# Altium project PA_Transmitter_1LD_ExtVoltage.PrjPcb
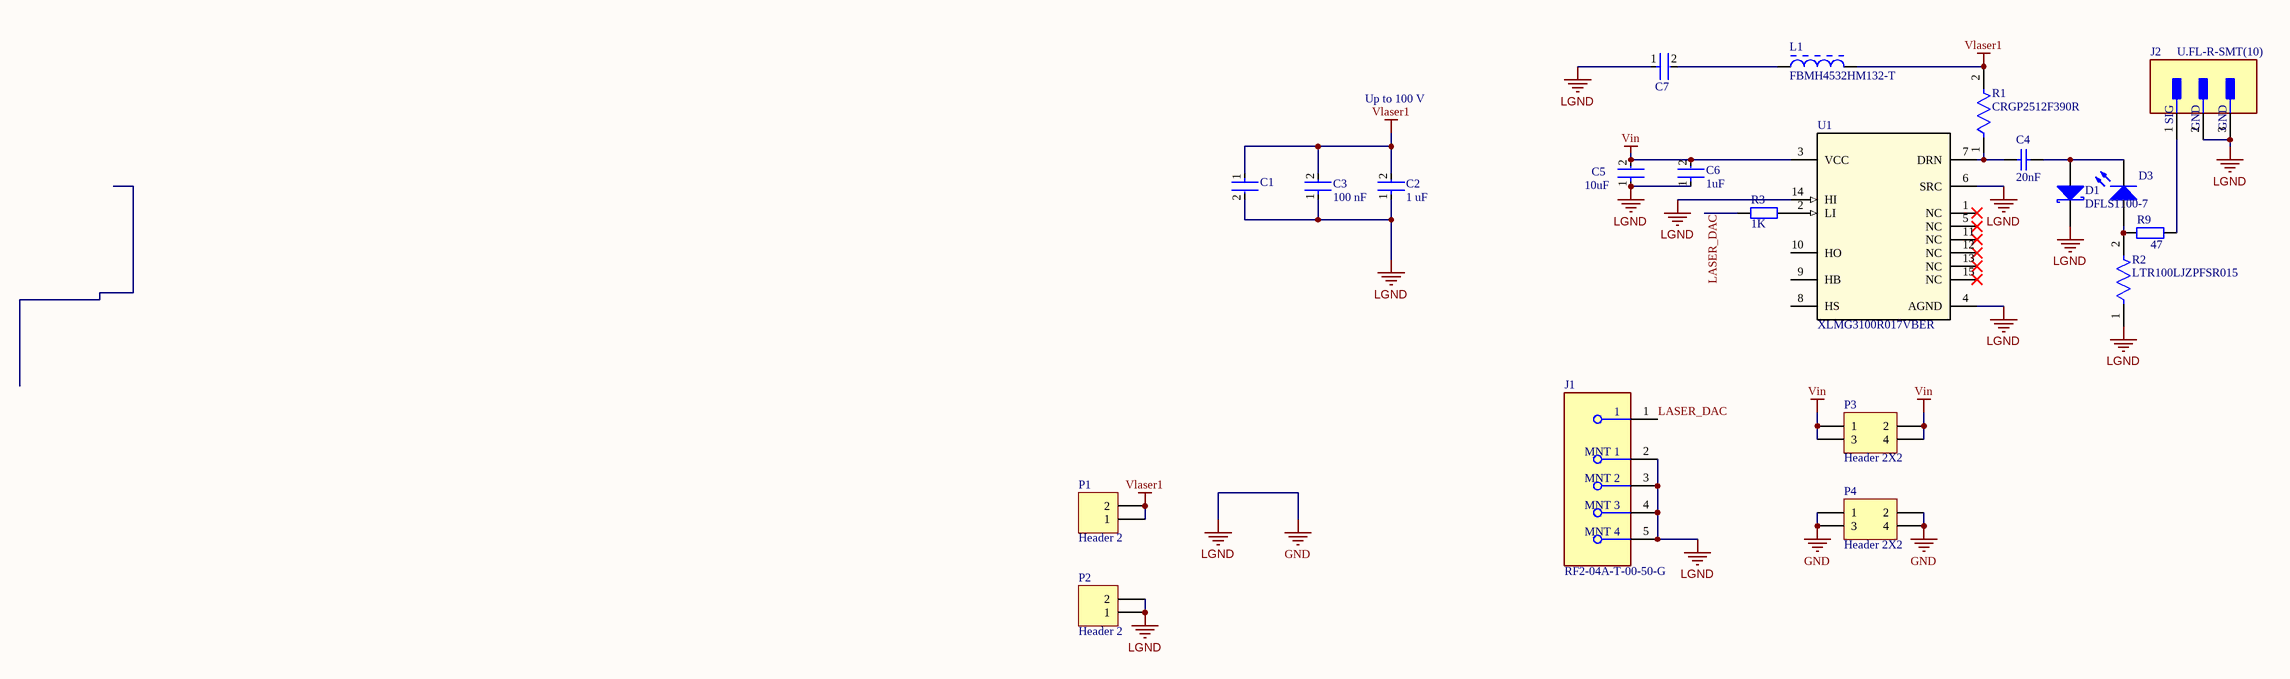
[diagram p0: PA_Transmitter_1LD_ExtVoltage.SchDoc]
1 sheet, 21 parts. Net scope: global (net labels, ports and power ports of the same name join across sheets).
Board file: PA_Transmitter_1LD_ExtVoltage.PcbDoc

## Sheet PA_Transmitter_1LD_ExtVoltage.SchDoc
size A3; PageSetup: Record=PageOptions|CenterHorizontal=True|CenterVertical=True|PrintScale=0.73|XCorrection=1.00|YCorrection=1.00|PrintKind=0|BorderSize=5000000|LeftOffset=0|BottomOffset=0|Orientation=2|PaperLength=1000|PaperWidth=1000|Scale=100|PaperSource=7|PrintQuality=-3|MediaType=1|DitherType=10|PrintScaleMode=1|PaperKind=A4|PaperIndex=9

### Parts
C1  CC1210KKX7R9BB105  [FP-CC1210-GA-MFG]  (value not drawn)
C2  1 uF  [FP-CL31B106KBHNNNE-MFG]
C3  100 nF  [FP-CL31B106KBHNNNE-MFG]
C4  20nF  [RESC2013X60X35ML10T20]
C5  10uF  [FP-CL31B106KBHNNNE-MFG]
C6  1uF  [FP-CL31B106KBHNNNE-MFG]
C7  CC1210KKX7R9BB105  [FP-CC1210-GA-MFG]  (value not drawn)
D1  DFLS1100-7  [DIOD-POWERDI123-2_V]
D3  Light-Emitting Diode  [FP-DPGEW1S09H-MFG]  (value not drawn)
J1  RF2-04A-T-00-50-G  [FP-RF2-04A-T-00-50-G-MFG]
J2  U.FL-R-SMT(10)  [FP-U_FL-R-SMT_10-MFG]
L1  FBMH4532HM132-T  [TAYO-FBMH4532-2_V]
P1  Header 2  [HDR1X2]
P2  Header 2  [HDR1X2]
P3  Header 2X2  [HDR2X2]
P4  Header 2X2  [HDR2X2]
R1  CRGP2512F390R  [FP-CRGP2512-IPC_C]
R2  LTR100LJZPFSR015  [FP-LTR100L-MFG]
R3  1K  [RESC2013X60X35ML10T20]
R9  47  [RESC2013X60X35ML10T20]
U1  XLMG3100R017VBER  [VBE0015A-MFG]

### Nets
GND: C1.2 C2.1 C3.1 C5.1 C6.1 C7.1 D1.2(K) J1.2(MNT_1) J1.3(MNT_2) J1.4(MNT_3) J1.5(MNT_4) J2.2(GND) J2.3(GND) P2.1 P2.2 P4.1 P4.2 P4.3 P4.4 R2.1 U1.4(AGND) U1.6(SRC) U1.14(HI)  [also labelled LGND]
Vin: C5.2 C6.2 P3.1 P3.2 P3.3 P3.4 U1.3(VCC)
Vlaser1: C1.1 C2.2 C3.2 L1.2 P1.1 P1.2 R1.2
LASER_DAC: J1.1 R3.2
NetC4_1: C4.1 D1.1(A) D3.2(K)
NetC4_2: C4.2 R1.1 U1.7(DRN)
NetC7_2: C7.2 L1.1
NetD3_1: D3.1(A) R2.2 R9.1
NetJ2_1: J2.1(SIG) R9.2
NetR3_1: R3.1 U1.2(LI)

Not connected (* = marked no-connect by the designer): U1 1(NC)* 5(NC)* 8(HS) 9(HB) 10(HO) 11(NC)* 12(NC)* 13(NC)* 15(NC)*

### Notes on the sheet
- Up to 100 V

### Library data of the parts
C1 C7 = CMP-03422-000918-1: CAP CER 1UF 50V X7R 1210; Manufacturer: Yageo; Temperature Coefficient: 15%; Description: Cap Ceramic 1uF 50V X7R 10% SMD 1210 125C T/R; Material: Ceramic; Tolerance: 10%; Manufacturer Part Number: CC1210KKX7R9BB105; RoHS: TRUE; Digikey Description: CAP CER 1UF 50V X7R 1210; Device Class L1: Passive Components; Temperature Range Low: -55°C; Value: 1uF; ComponentLink2Description: Datasheet; Temperature Characteristic: X7R; Capacitance: 1uF; Temperature: -55°C to +125°C; ComponentLink2URL: http://www.yageo.com/documents/recent/UPY-GPHC_X7R_6.3V-to-50V_18.pdf; Lead Free: Yes; Device Class L3: Ceramic Capacitors; Device Class L2: Capacitors; Category: Cap; Temperature Range High: +125°C; Package: CC1210-GA; Mouser Description: 1210 1 uF 50 V ±10 % Tolerance X7R SMT Multilayer Ceramic Capacitor; Octopart: https://octopart.com/cc1210kkx7r9bb105-yageo-22054290; Height: 1.45mm; Voltage Rating: 50V; Ipc Land Pattern Name: CAPC320250X125; Automotive: No; Footprint Url: http://www.yageo.com/exep/pages/download/literatures/UPY-C_GEN_24.pdf
C2 C3 C5 C6 = CMP-2000-07530-2: CAP CER 10UF 50V X7R 1206; Manufacturer: Samsung; Manufacturer Part Number: CL31B106KBHNNNE; Tolerance: 10%; Material: Ceramic; Temperature Coefficient: 15%; Temperature Characteristic: X7R; Digikey Description: CAP CER 10UF 50V X7R 1206; Device Class L1: Passive Components; Value: 10uF; Lead Free: Yes; Device Class L3: Ceramic Capacitors; Octopart: https://octopart.com/cl31b106kbhnnne-samsung-30507377; ComponentLink2URL: http://www.samsungsem.com/global/front/downloadcms.do?path=%2F%2Fglobal%2F%2Fsupport%2F%2Fproduct-search%2F%2Fmlcc%2F%2F__icsFiles%2F%2Fafieldfile%2F%2F2019%2F%2F06%2F%2F18&fileName=CL31B106KBHNNNE-19.pdf; Voltage Rating: 50V; Temperature Range Low: -55°C; RoHS: TRUE; Temperature: -55°C to +125°C; Category: Cap; ComponentLink2Description: Datasheet; Automotive: No; Device Class L2: Capacitors; Capacitance: 10uF; Height: 1.8mm; Temperature Range High: +125°C; Package: CL31B106KBHNNNE
C4 = CC0805: Chip capacitor; Voltage: 50V; Series: X7R; Value: 20nF
D1 = CMP-2000-05099-1: 1 A High Voltage Schottky Barrier Rectifier, 0.62 V, -55 to 175 degC, 2- Pin POWERDI123, Pb-Free, Tape and Reel; Manufacturer: Diodes Inc; Average Rectified Current-Max: 1A; Peak Current-Max: 40A; Forward Voltage: 0.77V; Reverse Current-Max: 1µA; Reverse Voltage-Max [Vrrm]: 100V; Datasheet Version: Sep-14; Datasheet URL: https://datasheet.ciiva.com/15144/getdatasheetpartid-44146-15144126.pdf; Manufacturer URL: http://www.diodes.com/
D3 = LED: AF: 1; BV: 0; BV_MAX: 1e99; EG: 1.11; FC: 0.5; IBV: 0.001; IS: 1e-14; MJSW: 0.33; NTUN: 30; TNOM: 27; XTI: 3; SimulationGenericComponent: True; CJO: 0; CJP: 0; CTA: 0; CTP: 0; FCS: 0.5; FV_MAX: 1e99; IKF: 0; IKR: 0; ISR: 1e-14; JSW: 0; JTUN: 0; JTUNSW: 0; KEG: 1; KF: 0; LEVEL: 1; N: 1; NBV: 1; NR: 1; NS: 1; PHP: 1; RS: 0; TCV: 0; TLEV: 0; TLEVC: 0; TM1: 0; TM2: 0; TPB: 0; TPHP: 0; TRS: 0; TRS2: 0; TT: 0; TTT1: 0; TTT2: 0; VJ: 1; XTITUN: 3
J1 = CMP-42753-000002-1: CONN SMA JACK STR 50 OHM PCB
J2 = CMP-0029-00003-2: CONN U.FL RCPT STR 50 OHM SMD; Plating: Silver; Connector Type: Coaxial; Frequency: 6GHz; Impedance: 50R; Body Material: Bronze; Dielectric Material: Polymer; Contact Plating: Gold; Termination: Solder; Orientation: Vertical; Contact Material: Brass; Min Operating Temperature: -40°C; Mount: Surface Mount; Lead Free: Lead Free; Max Operating Temperature: 90°C; Radiation Hardening: No; Packaging: Tape and Reel; Body Plating: Silver; Fastening Type: Snap; Max Frequency: 6GHz; Depth: 3.1mm; Package Quantity: 1; Case/Package: SMD/SMT; Housing Color: Beige; Length: 3mm
L1 = CMP-1526-00002-2: None; Impedance: 1.3kR; Number of Lines: 1; DC Resistance (DCR): 60mR; Core Material: Ferrite; Max DC Current: 3A; Tolerance: 25%; Test Frequency: 100MHz; Shielding: Unshielded; Halogen Free: Halogen Free; Case Code (Imperial): 1812; Package Quantity: 2000; Number of Pins: 2; RoHS Compliant: Yes; Length: 4.5mm; Case Code (Metric): 4532; Max Operating Temperature: 125°C; Max Current Rating: 3A; Series: FB; Packaging: Tape and Reel; Height: 3.2mm; Material: Ferrite; Termination: SMD/SMT; Lead Free: Lead Free; Depth: 3.5mm; Case/Package: 1812; Frequency: 100MHz; Current Rating: 3A; Width: 3.2mm; Resistor Type: Ferrite Bead; Min Operating Temperature: -40°C
P1 P2 = Header 2: Header, 2-Pin; LatestRevisionDate: 17-Jul-2002; LatestRevisionNote: Re-released for DXP Platform.; Publisher: Altium Limited
P3 P4 = Header 2X2: Header, 2-Pin, Dual row; LatestRevisionDate: 17-Jul-2002; LatestRevisionNote: Re-released for DXP Platform.; Publisher: Altium Limited
R1 = CMP-03211-008956-1: CRGP 2512 390R 1%; Manufacturer: TE; Temperature Coefficient: ±100ppm/°C; Tolerance: 0.01; Voltage Rating: 500V; Resistance: 390Ω; Description: CRGP2512 390Ω 2W ±100ppm/°C 1% 500V; Value: 390Ω; Power Rating: 2W; Ambient Temperature Range High: +70°C; Category: Res; Device Class L3: Chip SMD Resistors; Device Class L2: Resistors; ComponentLink2URL: https://www.mouser.ca/datasheet/2/418/NG_DS_9-1773463-9_A-1358566.pdf; Manufacturer Part Number: CRGP2512F390R; Series: CRGP; ComponentLink2Description: Datasheet; Height: 0.65mm; Composition: Thick Film; Package: CRGP2512; Automotive: No; Digikey Description: CRGP 2512 390R 1%; Temperature Range High: +155°C; Octopart: https://octopart.com/crgp2512f390r-te+connectivity-91019061; Temperature: -55°C to +155°C; Temperature Range Low: -55°C; RoHS: TRUE; Device Class L1: Passive Components; Lead Free: Yes; Ipc Land Pattern Name: RESC635320X55
R2 = CMP-00574-123977801-1: LTR100LJZPFSR015 Res 0.015 Ohm 1% 4W 2512 Wide; Resistance: 15mΩ; Composition: Thick Film; Max Operating Temperature: 155°C; Min Operating Temperature: -65°C; NexarPartId: 123977801; Case/Package: 2512; Tolerance: 1%; Height: 730µm; Power Rating: 4W
R3 R9 = RC0805: Chip resistor; Tolerance: 5%
  R3: Value: 1K
  R9: Value: 47
U1 = XLMG3100R017VBER: No Description Available; Mfr_Name: Texas Instruments; TYPE: TYPE; RefDes: RefDes